# Altium schematic sheet Tp_7seg.SchDoc
size A4
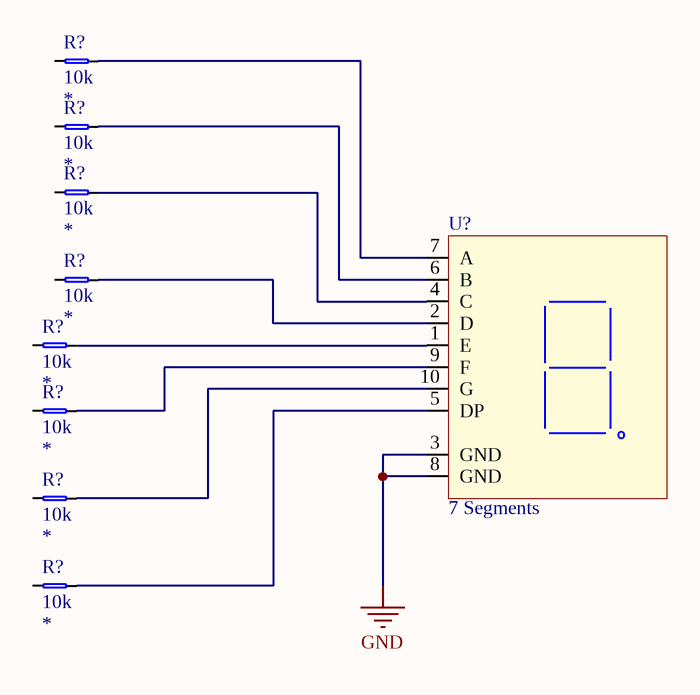
[diagram p0: Tp_7seg.SchDoc]

## Parts
(Parts that share a designator on the sheet are numbered #1, #2 ... from top to bottom, then left to right.)
R?#1  value 10k  [0603_RES_LD]  (hidden comment: Resistor)
R?#2  value 10k  [0603_RES_LD]  (hidden comment: Resistor)
R?#3  value 10k  [0603_RES_LD]  (hidden comment: Resistor)
R?#4  value 10k  [0603_RES_LD]  (hidden comment: Resistor)
R?#5  value 10k  [0603_RES_LD]  (hidden comment: Resistor)
R?#6  value 10k  [0603_RES_LD]  (hidden comment: Resistor)
R?#7  value 10k  [0603_RES_LD]  (hidden comment: Resistor)
R?#8  value 10k  [0603_RES_LD]  (hidden comment: Resistor)
U?  7 Segments  [SA10-21GWA]

## Nets
GND: U?.3(GND) U?.8(GND)
NetR?#1_2: R?#1.2 U?.7(A)
NetR?#2_2: R?#2.2 U?.6(B)
NetR?#3_2: R?#3.2 U?.4(C)
NetR?#4_2: R?#4.2 U?.2(D)
NetR?#5_2: R?#5.2 U?.1(E)
NetR?#6_2: R?#6.2 U?.9(F)
NetR?#7_2: R?#7.2 U?.10(G)
NetR?#8_2: R?#8.2 U?.5(DP)

Not connected (* = marked no-connect by the designer): R?#1 1; R?#2 1; R?#3 1; R?#4 1; R?#5 1; R?#6 1; R?#7 1; R?#8 1

## Library data of the parts
U? = SC10-21SRWA: KingBright Led 7 Segments; Reference: SC10-21SRWA
R?#1-R?#8 = Resistor: Precision: *; Package: *